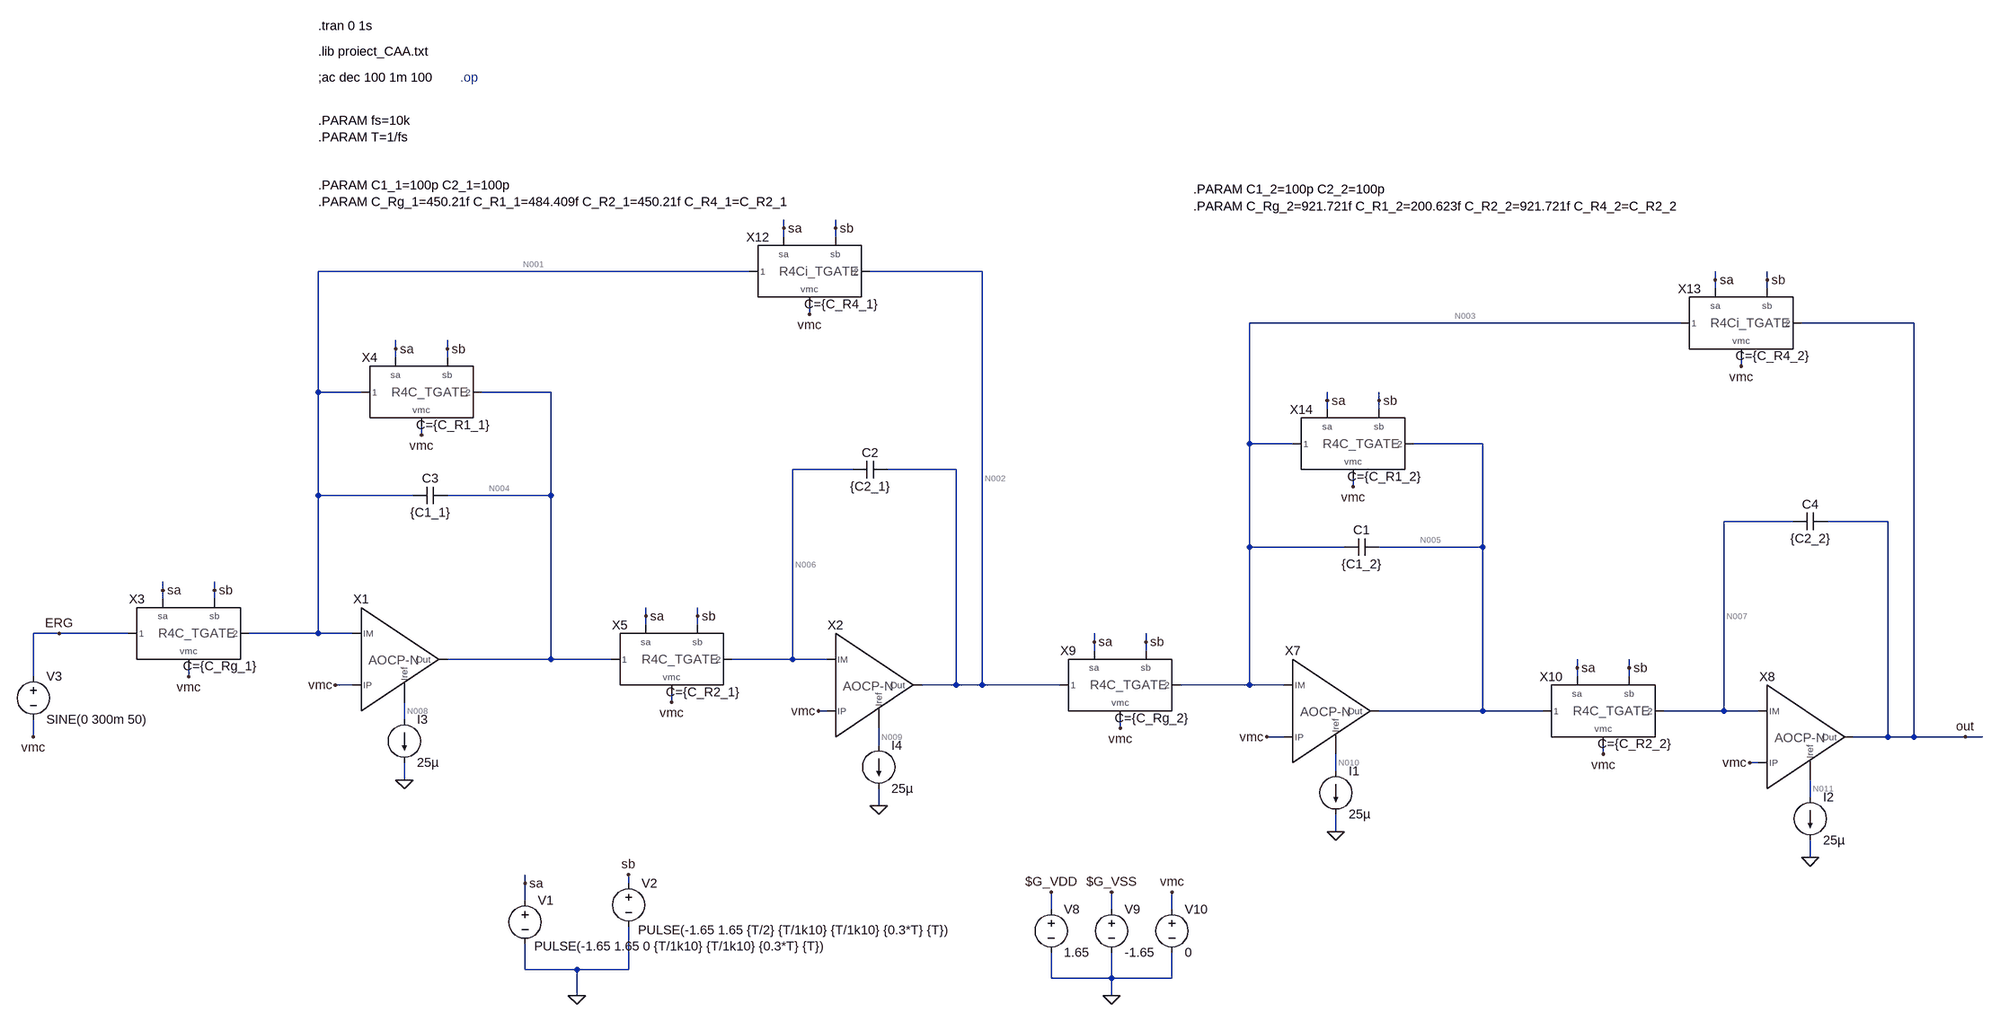
[diagram p0: schematic test_biquad_real_cc.asc]
test_biquad_real_cc.asc, the LTspice schematic file:
Version 4
SHEET 1 4456 2500
WIRE 1360 752 1360 736
WIRE 1456 752 1456 736
WIRE 1360 768 1360 752
WIRE 1456 768 1456 752
WIRE 1296 832 496 832
WIRE 1728 832 1520 832
WIRE 3088 848 3088 832
WIRE 3184 848 3184 832
WIRE 3088 864 3088 848
WIRE 3184 864 3184 848
WIRE 1408 912 1408 896
WIRE 3024 928 2224 928
WIRE 3456 928 3248 928
WIRE 640 976 640 960
WIRE 736 976 736 960
WIRE 640 992 640 976
WIRE 736 992 736 976
WIRE 3136 1008 3136 992
WIRE 496 1056 496 832
WIRE 576 1056 496 1056
WIRE 928 1056 800 1056
WIRE 2368 1072 2368 1056
WIRE 2464 1072 2464 1056
WIRE 2368 1088 2368 1072
WIRE 2464 1088 2464 1072
WIRE 688 1136 688 1120
WIRE 2224 1152 2224 928
WIRE 2304 1152 2224 1152
WIRE 2656 1152 2528 1152
WIRE 1488 1200 1376 1200
WIRE 1680 1200 1552 1200
WIRE 2416 1232 2416 1216
WIRE 496 1248 496 1056
WIRE 672 1248 496 1248
WIRE 928 1248 928 1056
WIRE 928 1248 736 1248
WIRE 3232 1296 3104 1296
WIRE 3408 1296 3296 1296
WIRE 2224 1344 2224 1152
WIRE 2400 1344 2224 1344
WIRE 2656 1344 2656 1152
WIRE 2656 1344 2464 1344
WIRE 208 1424 208 1408
WIRE 304 1424 304 1408
WIRE 208 1440 208 1424
WIRE 304 1440 304 1424
WIRE 1104 1472 1104 1456
WIRE 1200 1472 1200 1456
WIRE 1104 1488 1104 1472
WIRE 1200 1488 1200 1472
WIRE 16 1504 -32 1504
WIRE 144 1504 16 1504
WIRE 496 1504 496 1248
WIRE 496 1504 368 1504
WIRE 560 1504 496 1504
WIRE 1936 1520 1936 1504
WIRE 2032 1520 2032 1504
WIRE 1936 1536 1936 1520
WIRE 2032 1536 2032 1520
WIRE 928 1552 928 1248
WIRE 928 1552 736 1552
WIRE 1040 1552 928 1552
WIRE 1376 1552 1376 1200
WIRE 1376 1552 1264 1552
WIRE 1440 1552 1376 1552
WIRE 2832 1568 2832 1552
WIRE 2928 1568 2928 1552
WIRE -32 1584 -32 1504
WIRE 256 1584 256 1568
WIRE 2832 1584 2832 1568
WIRE 2928 1584 2928 1568
WIRE 560 1600 528 1600
WIRE 1680 1600 1680 1200
WIRE 1680 1600 1616 1600
WIRE 1728 1600 1728 832
WIRE 1728 1600 1680 1600
WIRE 1872 1600 1728 1600
WIRE 2224 1600 2224 1344
WIRE 2224 1600 2096 1600
WIRE 2288 1600 2224 1600
WIRE 1152 1632 1152 1616
WIRE 1440 1648 1424 1648
WIRE 2656 1648 2656 1344
WIRE 2656 1648 2464 1648
WIRE 2768 1648 2656 1648
WIRE 3104 1648 3104 1296
WIRE 3104 1648 2992 1648
WIRE 3168 1648 3104 1648
WIRE 656 1664 656 1632
WIRE 1984 1680 1984 1664
WIRE -32 1696 -32 1664
WIRE 2288 1696 2256 1696
WIRE 3408 1696 3408 1296
WIRE 3408 1696 3344 1696
WIRE 3456 1696 3456 928
WIRE 3456 1696 3408 1696
WIRE 3552 1696 3456 1696
WIRE 3584 1696 3552 1696
WIRE 1536 1712 1536 1680
WIRE 2880 1728 2880 1712
WIRE 3168 1744 3152 1744
WIRE 2384 1760 2384 1728
WIRE 656 1776 656 1744
WIRE 3264 1808 3264 1776
WIRE 1536 1824 1536 1792
WIRE 2384 1872 2384 1840
WIRE 3264 1920 3264 1888
WIRE 880 1968 880 1952
WIRE 1072 1968 1072 1952
WIRE 880 2000 880 1968
WIRE 1856 2016 1856 1984
WIRE 1968 2016 1968 1984
WIRE 2080 2016 2080 1984
WIRE 880 2128 880 2080
WIRE 976 2128 880 2128
WIRE 1072 2128 1072 2048
WIRE 1072 2128 976 2128
WIRE 1856 2144 1856 2096
WIRE 1968 2144 1968 2096
WIRE 1968 2144 1856 2144
WIRE 2080 2144 2080 2096
WIRE 2080 2144 1968 2144
WIRE 976 2176 976 2128
WIRE 1968 2176 1968 2144
FLAG 528 1600 vmc
FLAG 1424 1648 vmc
FLAG 1968 2176 0
FLAG 1856 1984 $G_VDD
FLAG 1968 1984 $G_VSS
FLAG 2080 1984 vmc
FLAG 656 1776 0
FLAG 1536 1824 0
FLAG 976 2176 0
FLAG 880 1968 sa
FLAG 1072 1952 sb
FLAG 256 1584 vmc
FLAG 208 1424 sa
FLAG 304 1424 sb
FLAG 1408 912 vmc
FLAG 1360 752 sa
FLAG 1456 752 sb
FLAG 1152 1632 vmc
FLAG 1104 1472 sa
FLAG 1200 1472 sb
FLAG 688 1136 vmc
FLAG 640 976 sa
FLAG 736 976 sb
FLAG 2256 1696 vmc
FLAG 3152 1744 vmc
FLAG 2384 1872 0
FLAG 3264 1920 0
FLAG 1984 1680 vmc
FLAG 1936 1520 sa
FLAG 2032 1520 sb
FLAG 3136 1008 vmc
FLAG 3088 848 sa
FLAG 3184 848 sb
FLAG 2880 1728 vmc
FLAG 2832 1568 sa
FLAG 2928 1568 sb
FLAG 2416 1232 vmc
FLAG 2368 1072 sa
FLAG 2464 1072 sb
FLAG 3552 1696 out
FLAG -32 1696 vmc
FLAG 16 1504 ERG
SYMBOL voltage 1856 2000 R0
WINDOW 123 0 0 Left 2
WINDOW 39 0 0 Left 2
SYMATTR InstName V8
SYMATTR Value 1.65
SYMBOL voltage 1968 2000 R0
WINDOW 123 0 0 Left 2
WINDOW 39 0 0 Left 2
SYMATTR InstName V9
SYMATTR Value -1.65
SYMBOL voltage 2080 2000 R0
WINDOW 123 0 0 Left 2
WINDOW 39 0 0 Left 2
SYMATTR InstName V10
SYMATTR Value 0
SYMBOL ao_cp_n 608 1552 R0
SYMATTR InstName X1
SYMBOL current 656 1664 R0
WINDOW 123 0 0 Left 0
WINDOW 39 0 0 Left 0
SYMATTR InstName I3
SYMATTR Value 25µ
SYMBOL ao_cp_n 1488 1600 R0
SYMATTR InstName X2
SYMBOL current 1536 1712 R0
WINDOW 123 0 0 Left 0
WINDOW 39 0 0 Left 0
SYMATTR InstName I4
SYMATTR Value 25µ
SYMBOL cap 736 1232 R90
WINDOW 0 0 32 VBottom 2
WINDOW 3 32 32 VTop 2
SYMATTR InstName C3
SYMATTR Value {C1_1}
SYMBOL voltage 880 1984 R0
WINDOW 123 0 0 Left 2
WINDOW 39 0 0 Left 2
WINDOW 3 17 101 Left 2
SYMATTR Value PULSE(-1.65 1.65 0 {T/1k10} {T/1k10} {0.3*T} {T})
SYMATTR InstName V1
SYMBOL voltage 1072 1952 R0
WINDOW 123 0 0 Left 2
WINDOW 39 0 0 Left 2
WINDOW 3 18 103 Left 2
SYMATTR Value PULSE(-1.65 1.65 {T/2} {T/1k10} {T/1k10} {0.3*T} {T})
SYMATTR InstName V2
SYMBOL R4C_TGATE 352 1552 R0
SYMATTR InstName X3
SYMATTR SpiceLine C={C_Rg_1}
SYMBOL R4C_TGATE 1248 1600 R0
SYMATTR InstName X5
SYMATTR SpiceLine C={C_R2_1}
SYMBOL R4Ci_TGATE 1504 880 R0
SYMATTR InstName X12
SYMATTR SpiceLine C={C_R4_1}
SYMBOL R4C_TGATE 784 1104 R0
SYMATTR InstName X4
SYMATTR SpiceLine C={C_R1_1}
SYMBOL ao_cp_n 2336 1648 R0
SYMATTR InstName X7
SYMBOL current 2384 1760 R0
WINDOW 123 0 0 Left 0
WINDOW 39 0 0 Left 0
SYMATTR InstName I1
SYMATTR Value 25µ
SYMBOL ao_cp_n 3216 1696 R0
SYMATTR InstName X8
SYMBOL current 3264 1808 R0
WINDOW 123 0 0 Left 0
WINDOW 39 0 0 Left 0
SYMATTR InstName I2
SYMATTR Value 25µ
SYMBOL cap 2464 1328 R90
WINDOW 0 0 32 VBottom 2
WINDOW 3 32 32 VTop 2
SYMATTR InstName C1
SYMATTR Value {C1_2}
SYMBOL R4C_TGATE 2080 1648 R0
SYMATTR InstName X9
SYMATTR SpiceLine C={C_Rg_2}
SYMBOL R4C_TGATE 2976 1696 R0
SYMATTR InstName X10
SYMATTR SpiceLine C={C_R2_2}
SYMBOL R4Ci_TGATE 3232 976 R0
SYMATTR InstName X13
SYMATTR SpiceLine C={C_R4_2}
SYMBOL R4C_TGATE 2512 1200 R0
SYMATTR InstName X14
SYMATTR SpiceLine C={C_R1_2}
SYMBOL cap 1552 1184 R90
WINDOW 0 0 32 VBottom 2
WINDOW 3 32 32 VTop 2
SYMATTR InstName C2
SYMATTR Value {C2_1}
SYMBOL cap 3296 1280 R90
WINDOW 0 0 32 VBottom 2
WINDOW 3 32 32 VTop 2
SYMATTR InstName C4
SYMATTR Value {C2_2}
SYMBOL voltage -32 1568 R0
WINDOW 123 0 0 Left 2
WINDOW 39 0 0 Left 2
SYMATTR InstName V3
SYMATTR Value SINE(0 300m 50)
TEXT 496 424 Left 2 !.lib proiect_CAA.txt
TEXT 496 472 Left 2 !;ac dec 100 1m 100
TEXT 760 472 Left 2 ;.op
TEXT 496 672 Left 2 !.PARAM C1_1=100p C2_1=100p\n.PARAM C_Rg_1=450.21f C_R1_1=484.409f C_R2_1=450.21f C_R4_1=C_R2_1
TEXT 2120 680 Left 2 !.PARAM C1_2=100p C2_2=100p\n.PARAM C_Rg_2=921.721f C_R1_2=200.623f C_R2_2=921.721f C_R4_2=C_R2_2
TEXT 496 376 Left 2 !.tran 0 1s
TEXT 496 552 Left 2 !.PARAM fs=10k\n.PARAM T=1/fs

The netlist it stands for:
* test_biquad_real_cc.asc
V8 $G_VDD 0 1.65
V9 $G_VSS 0 -1.65
V10 vmc 0 0
XX1 N001 vmc N004 N008 ao_cp_n  ; pins IM IP Out Iref
I3 N008 0 25µ
XX2 N006 vmc N002 N009 ao_cp_n  ; pins IM IP Out Iref
I4 N009 0 25µ
C3 N004 N001 {C1_1}
V1 sa 0 PULSE(-1.65 1.65 0 {T/1k10} {T/1k10} {0.3*T} {T})
V2 sb 0 PULSE(-1.65 1.65 {T/2} {T/1k10} {T/1k10} {0.3*T} {T})
XX3 ERG N001 sa sb vmc R4C_TGATE params: C={C_Rg_1}  ; pins 1 2 sa sb vmc
XX5 N004 N006 sa sb vmc R4C_TGATE params: C={C_R2_1}  ; pins 1 2 sa sb vmc
XX12 N001 N002 sa sb vmc R4Ci_TGATE params: C={C_R4_1}  ; pins 1 2 sa sb vmc
XX4 N001 N004 sa sb vmc R4C_TGATE params: C={C_R1_1}  ; pins 1 2 sa sb vmc
XX7 N003 vmc N005 N010 ao_cp_n  ; pins IM IP Out Iref
I1 N010 0 25µ
XX8 N007 vmc out N011 ao_cp_n  ; pins IM IP Out Iref
I2 N011 0 25µ
C1 N005 N003 {C1_2}
XX9 N002 N003 sa sb vmc R4C_TGATE params: C={C_Rg_2}  ; pins 1 2 sa sb vmc
XX10 N005 N007 sa sb vmc R4C_TGATE params: C={C_R2_2}  ; pins 1 2 sa sb vmc
XX13 N003 out sa sb vmc R4Ci_TGATE params: C={C_R4_2}  ; pins 1 2 sa sb vmc
XX14 N003 N005 sa sb vmc R4C_TGATE params: C={C_R1_2}  ; pins 1 2 sa sb vmc
C2 N002 N006 {C2_1}
C4 out N007 {C2_2}
V3 ERG vmc SINE(0 300m 50)
.lib proiect_CAA.txt
;ac dec 100 1m 100
* .op
.PARAM C1_1=100p C2_1=100p
.PARAM C_Rg_1=450.21f C_R1_1=484.409f C_R2_1=450.21f C_R4_1=C_R2_1
.PARAM C1_2=100p C2_2=100p
.PARAM C_Rg_2=921.721f C_R1_2=200.623f C_R2_2=921.721f C_R4_2=C_R2_2
.tran 0 1s
.PARAM fs=10k
.PARAM T=1/fs
.backanno
.end

* Results of the author's LTspice run, read from the files saved beside the schematic
* Operating Point, zero values left out:
*   V($g_vdd) = 1.65 V
*   V($g_vss) = -1.65 V
*   V(n008) = 251.8 mV
*   V(n001) = 825 mV
*   V(n004) = -1.645 V
*   V(n009) = 251.8 mV
*   V(n006) = 825 mV
*   V(n002) = -1.645 V
*   V(sa) = -1.65 V
*   V(sb) = -1.65 V
*   V(n010) = 251.8 mV
*   V(n003) = 825 mV
*   V(n005) = -1.645 V
*   V(n011) = 251.8 mV
*   V(n007) = 825 mV
*   V(out) = -1.645 V
*   I(I2) = 25 µA
*   I(I1) = 25 µA
*   I(I4) = 25 µA
*   I(I3) = 25 µA
*   I(V3) = 3.3 pA
*   I(V10) = 56.1 pA
*   I(V9) = 1.149 mA
*   I(V8) = -1.249 mA